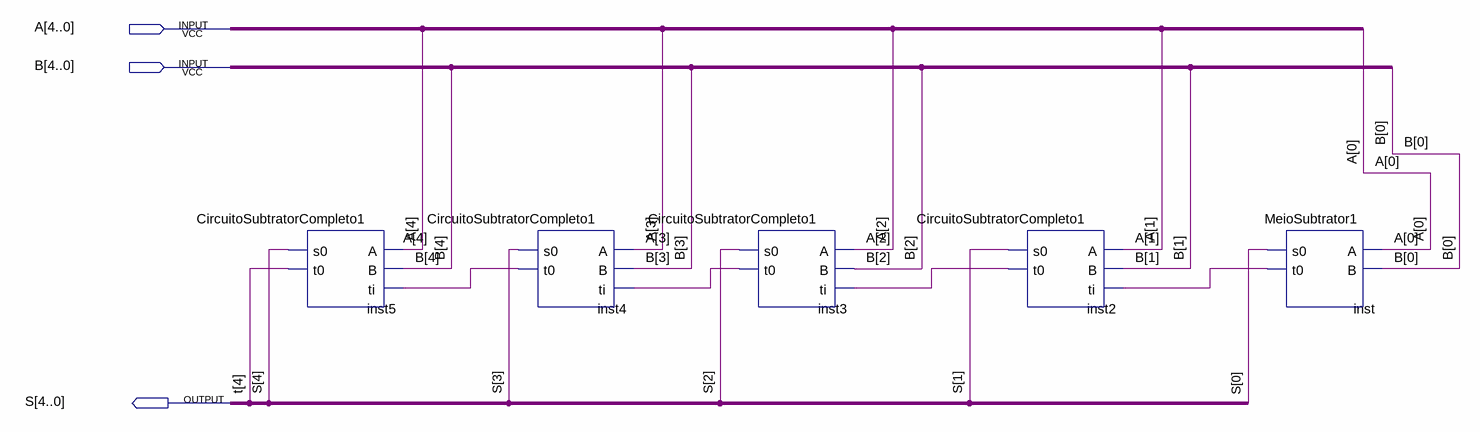
[diagram p0: schematic sheet]
// Quartus schematic Subtrator5bits.bdf as structural Verilog: 5 symbols, 3 pins
module Subtrator5bits (
  input  [4:0] A,
  input  [4:0] B,
  output [4:0] S
);

  wire inst2_t0, inst3_t0, inst4_t0, inst_t0;
  wire [4:4] t;

  CircuitoSubtratorCompleto1 inst5 (.A(A[4]), .B(B[4]), .ti(inst4_t0), .s0(S[4]), .t0(t[4]));
  CircuitoSubtratorCompleto1 inst4 (.A(A[3]), .B(B[3]), .ti(inst3_t0), .s0(S[3]), .t0(inst4_t0));
  CircuitoSubtratorCompleto1 inst3 (.A(A[2]), .B(B[2]), .ti(inst2_t0), .s0(S[2]), .t0(inst3_t0));
  CircuitoSubtratorCompleto1 inst2 (.A(A[1]), .B(B[1]), .ti(inst_t0), .s0(S[1]), .t0(inst2_t0));
  MeioSubtrator1 inst (.A(A[0]), .B(B[0]), .s0(S[0]), .t0(inst_t0));
endmodule
